# EAGLE design ATtiny_4585_and_4484_programmer (EAGLE 6.1)
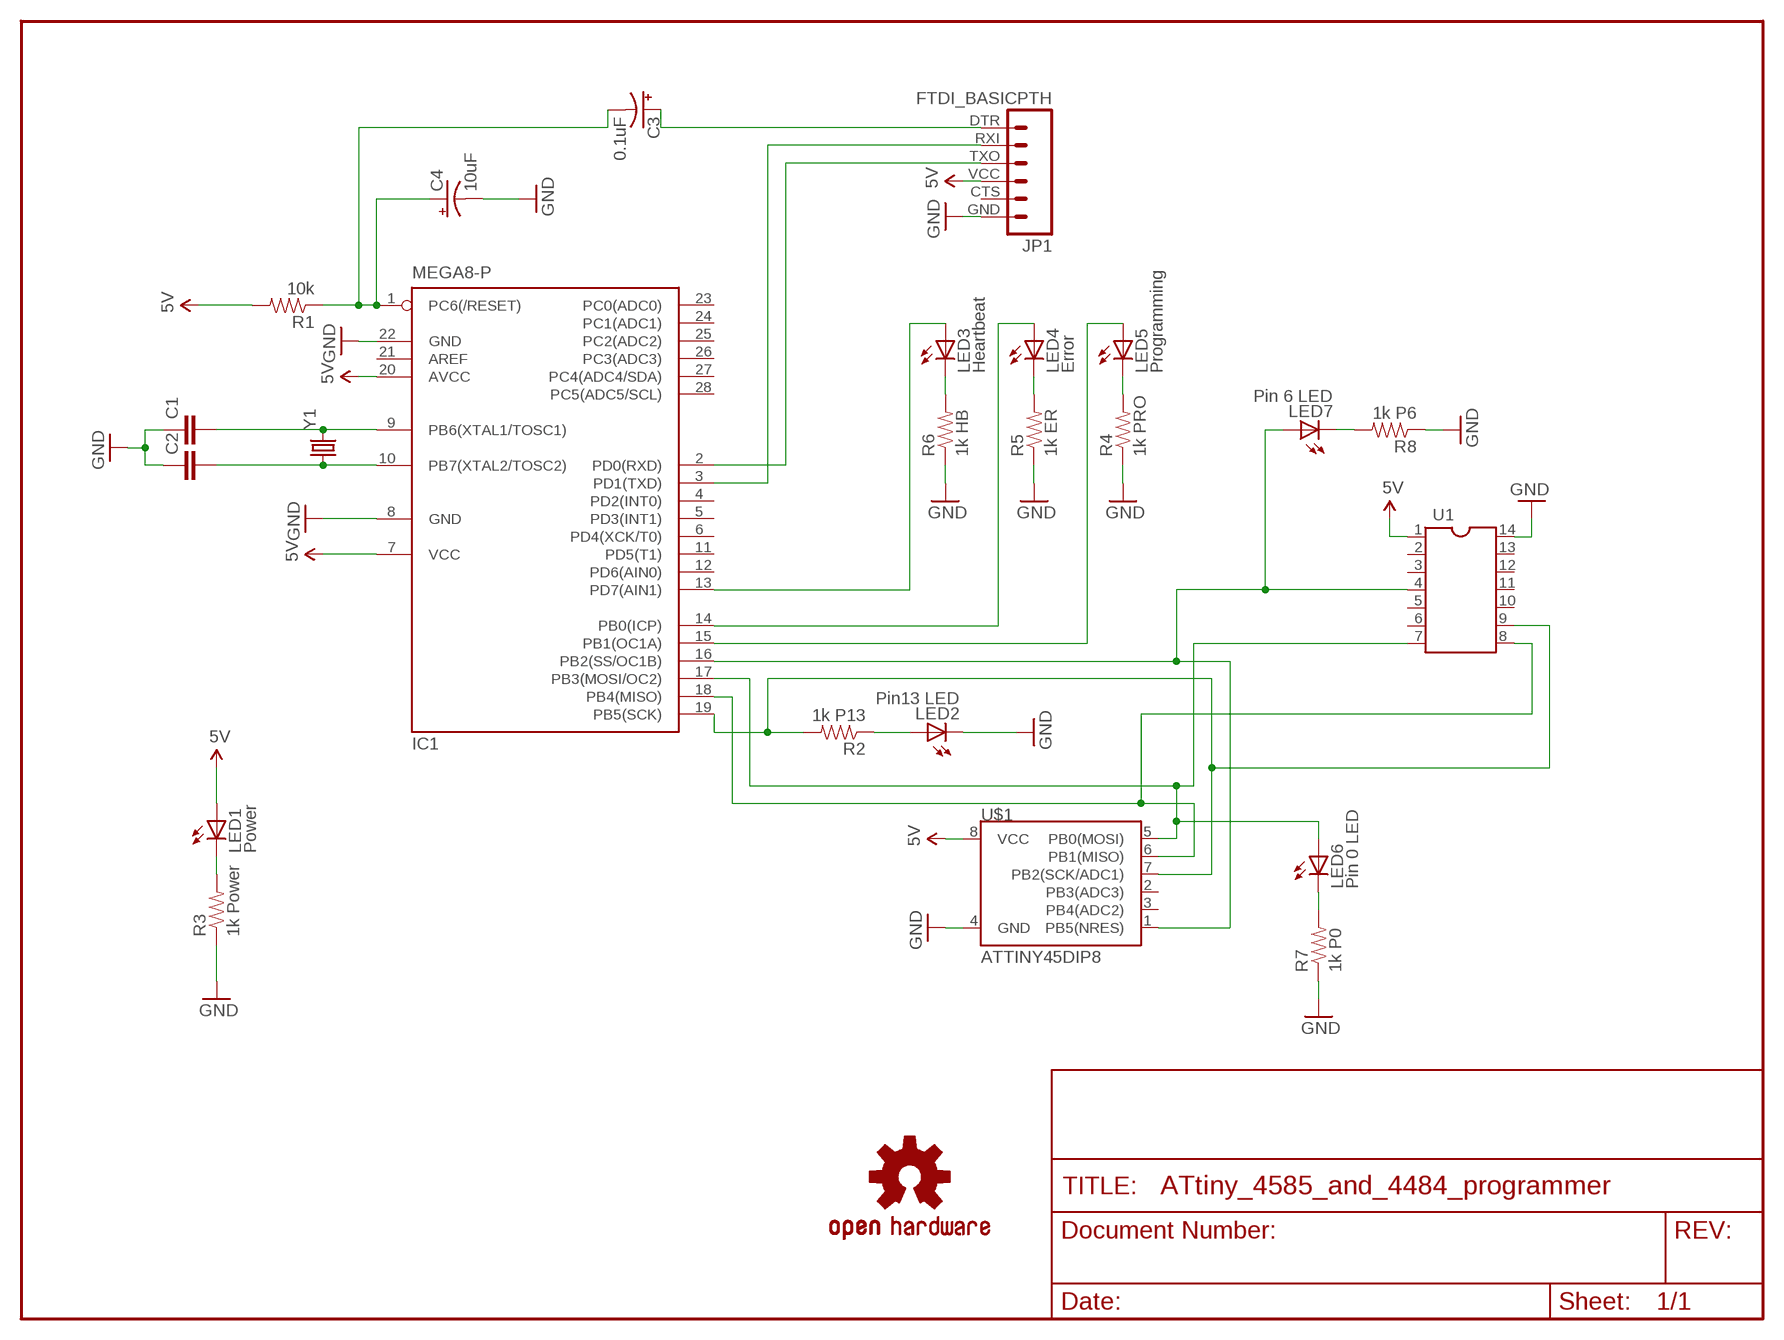
[diagram p0: schematic, sheet 1]

## Parts
C1  CAPPTH  [CAP-PTH-SMALL]
C2  CAPPTH  [CAP-PTH-SMALL]
C3  0.1uF  CAP_POLPTH2  [CPOL-RADIAL-10UF-25V]
C4  10uF  CAP_POLPTH2  [CPOL-RADIAL-10UF-25V]
IC1  MEGA8-P  [DIL28-3]
JP1  FTDI_BASICPTH  [FTDI_BASIC]
LED1  Power  LED5MM  [LED5MM]
LED2  Pin13 LED  LED5MM  [LED5MM]
LED3  Heartbeat  LED5MM  [LED5MM]
LED4  Error  LED5MM  [LED5MM]
LED5  Programming  LED5MM  [LED5MM]
LED6  Pin 0 LED  LED5MM  [LED5MM]
LED7  Pin 6 LED  LED5MM  [LED5MM]
R1  10k  RESISTORPTH-1/4W  [AXIAL-0.4]
R2  1k P13  RESISTORPTH-1/4W  [AXIAL-0.4]
R3  1k Power  RESISTORPTH-1/4W  [AXIAL-0.4]
R4  1k PRO  RESISTORPTH-1/4W  [AXIAL-0.4]
R5  1k ER  RESISTORPTH-1/4W  [AXIAL-0.4]
R6  1k HB  RESISTORPTH-1/4W  [AXIAL-0.4]
R7  1k P0  RESISTORPTH-1/4W  [AXIAL-0.4]
R8  1k P6  RESISTORPTH-1/4W  [AXIAL-0.4]
U1  DIL14  [DIL14]
U$1  ATTINY45DIP8  [DIP08]
U$9  OSHW-LOGOM  [OSHW-LOGO-M]
Y1  CRYSTALHC49US  [HC49US]

## Nets
5V: IC1.7(VCC) IC1.20(AVCC) JP1.VCC LED1.A R1.P$2 U1.1 U$1.8(VCC)
GND: C1.1 C2.1 C4.2(-) IC1.8(GND) IC1.22(GND) JP1.GND LED2.K(C) R3.P$1 R4.P$1 R5.P$1 R6.P$1 R7.P$1 R8.P$1 U1.14 U$1.4(GND)
N$1: C1.2 IC1.9(PB6(XTAL1/TOSC1)) Y1.2
N$2: C2.2 IC1.10(PB7(XTAL2/TOSC2)) Y1.1
N$3: C3.1(+) JP1.DTR
N$6: IC1.16(PB2(SS/OC1B)) LED7.A U1.4 U$1.1(PB5(NRES))
N$7: IC1.3(PD1(TXD)) JP1.RXI
N$8: IC1.2(PD0(RXD)) JP1.TXO
N$9: LED1.K(C) R3.P$2
N$10: IC1.19(PB5(SCK)) R2.P$2 U1.9 U$1.7(PB2(SCK/ADC1))
N$11: LED2.A R2.P$1
N$12: IC1.17(PB3(MOSI/OC2)) LED6.A U1.7 U$1.5(PB0(MOSI))
N$13: IC1.18(PB4(MISO)) U1.8 U$1.6(PB1(MISO))
N$14: IC1.14(PB0(ICP)) LED4.A
N$15: IC1.13(PD7(AIN1)) LED3.A
N$16: LED3.K(C) R6.P$2
N$17: LED4.K(C) R5.P$2
N$18: LED5.K(C) R4.P$2
N$19: IC1.15(PB1(OC1A)) LED5.A
N$20: C3.2(-) C4.1(+) IC1.1(PC6(/RESET)) R1.P$1
N$21: LED6.K(C) R7.P$2
N$22: LED7.K(C) R8.P$2
Unconnected: IC1.4(PD2(INT0)) IC1.5(PD3(INT1)) IC1.6(PD4(XCK/T0)) IC1.11(PD5(T1)) IC1.12(PD6(AIN0)) IC1.21(AREF) IC1.23(PC0(ADC0)) IC1.24(PC1(ADC1)) IC1.25(PC2(ADC2)) IC1.26(PC3(ADC3)) IC1.27(PC4(ADC4/SDA)) IC1.28(PC5(ADC5/SCL)) JP1.CTS U1.2 U1.3 U1.5 U1.6 U1.10 U1.11 U1.12 U1.13 U$1.2(PB3(ADC3)) U$1.3(PB4(ADC2))

## Library data of the parts
C1 C2 = SparkFun:CAP: Capacitor Standard 0603 ceramic capacitor, and 0.1" leaded capacitor.
C3 C4 = SparkFun:CAP_POL: Capacitor Polarized These are standard SMD and PTH capacitors. Normally 10uF, 47uF, and 100uF in electrolytic and tantalum varieties. Always verify the external diameter of the through hole cap, it varies with capacity, voltage, and manufacturer. The EIA devices should be standard.
IC1 = atmel:MEGA8-P: MICROCONTROLLER 8 Kbytes FLASH, 1 kbytes SRAM, 512 bytes EEPROM, USART, 4-channel 10 bit ADC, 2-channel 8 bit ADC Pin compatible with Atmega48, ATMega88, ATMega168 Source: avr.lbr; OC_FARNELL: unknown; OC_NEWARK: unknown
JP1 = SparkFun:FTDI_BASIC: FTDI Basic: 3.3V and 5V
LED1-LED7 = SparkFun:LED: LEDs Standard schematic elements and footprints for 5mm, 3mm, 1206, and 0603 sized LEDs. 5mm - Spark Fun Electronics SKU : COM-00529 (and others)
R1-R8 = SparkFun:RESISTOR: Resistor Basic schematic elements and footprints for 0603, 1206, and PTH resistors.
U1 = map:DIL14
U$1 = SparkFun:ATTINY45: Atmel ATTiny45
U$9 = SparkFun:OSHW-LOGO: Open Source Hardware Logo This logo indicates the piece of hardware it is found on incorporates a OSHW license and/or adheres to the definition of open source hardware found here: http://freedomdefined.org/OSHW
Y1 = SparkFun:CRYSTAL: Crystals Various standard crystals. Proven footprints. Spark Fun Electronics SKU : COM-00534

## Board
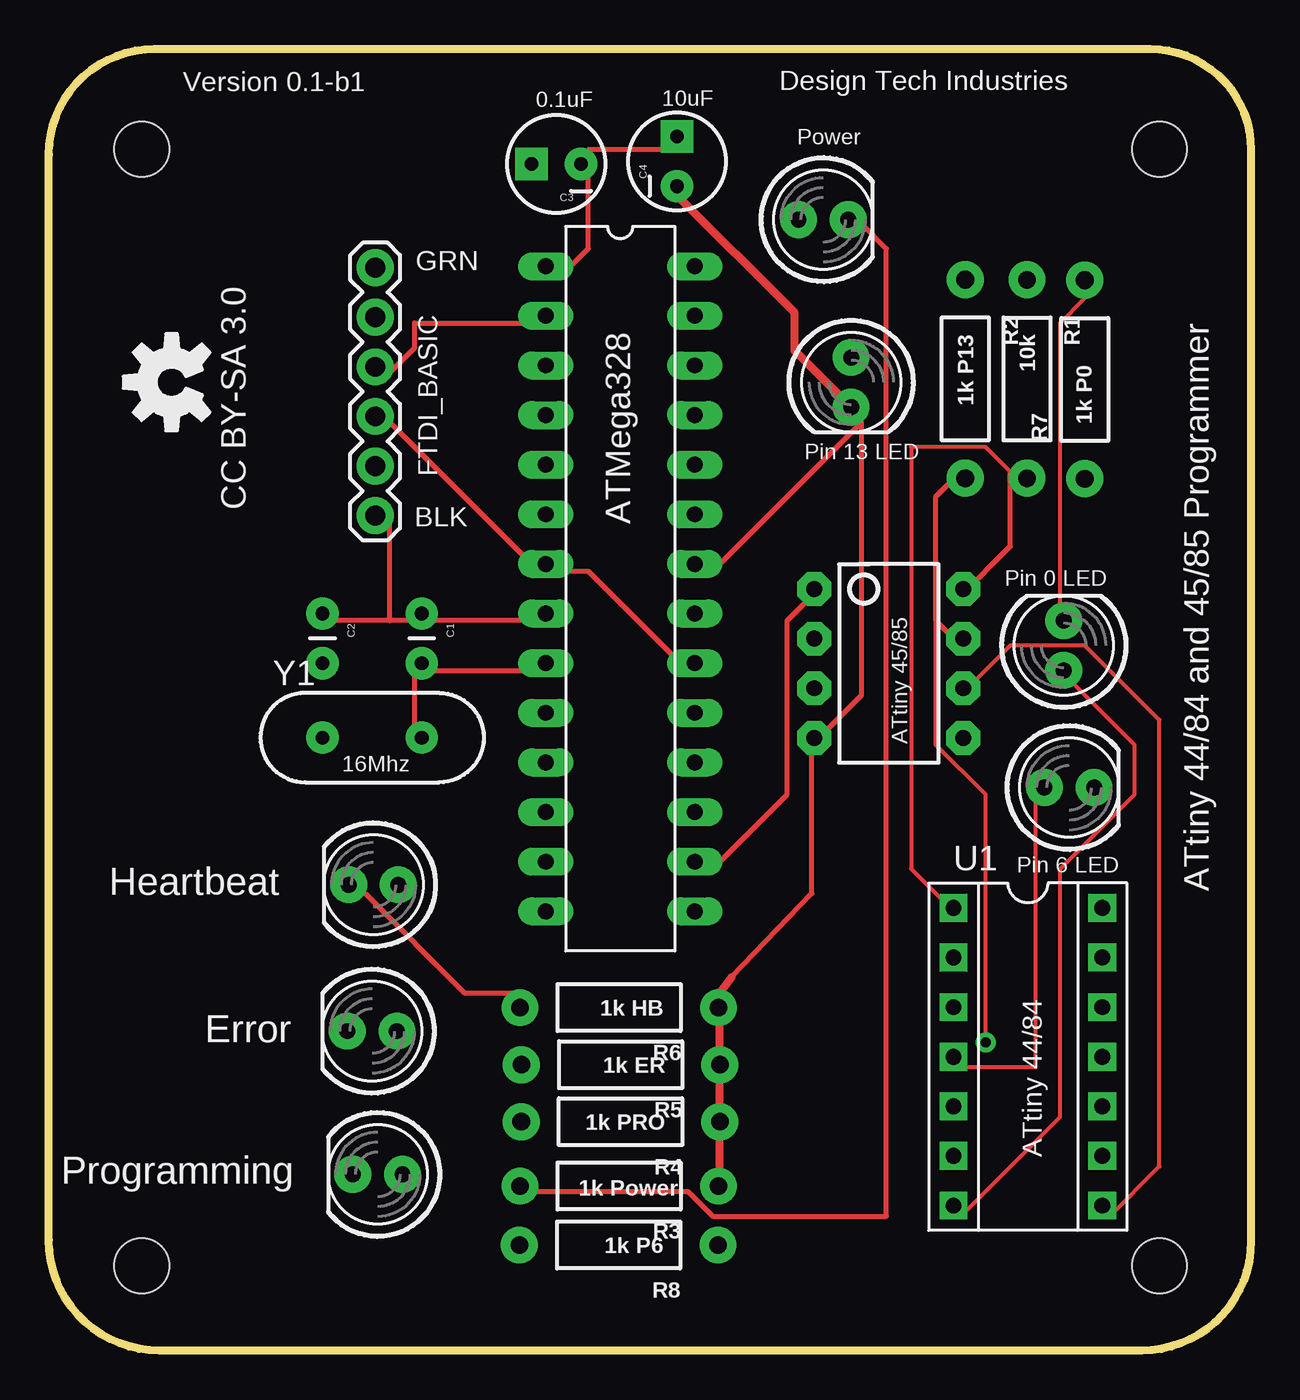
[diagram p1: board, top side]
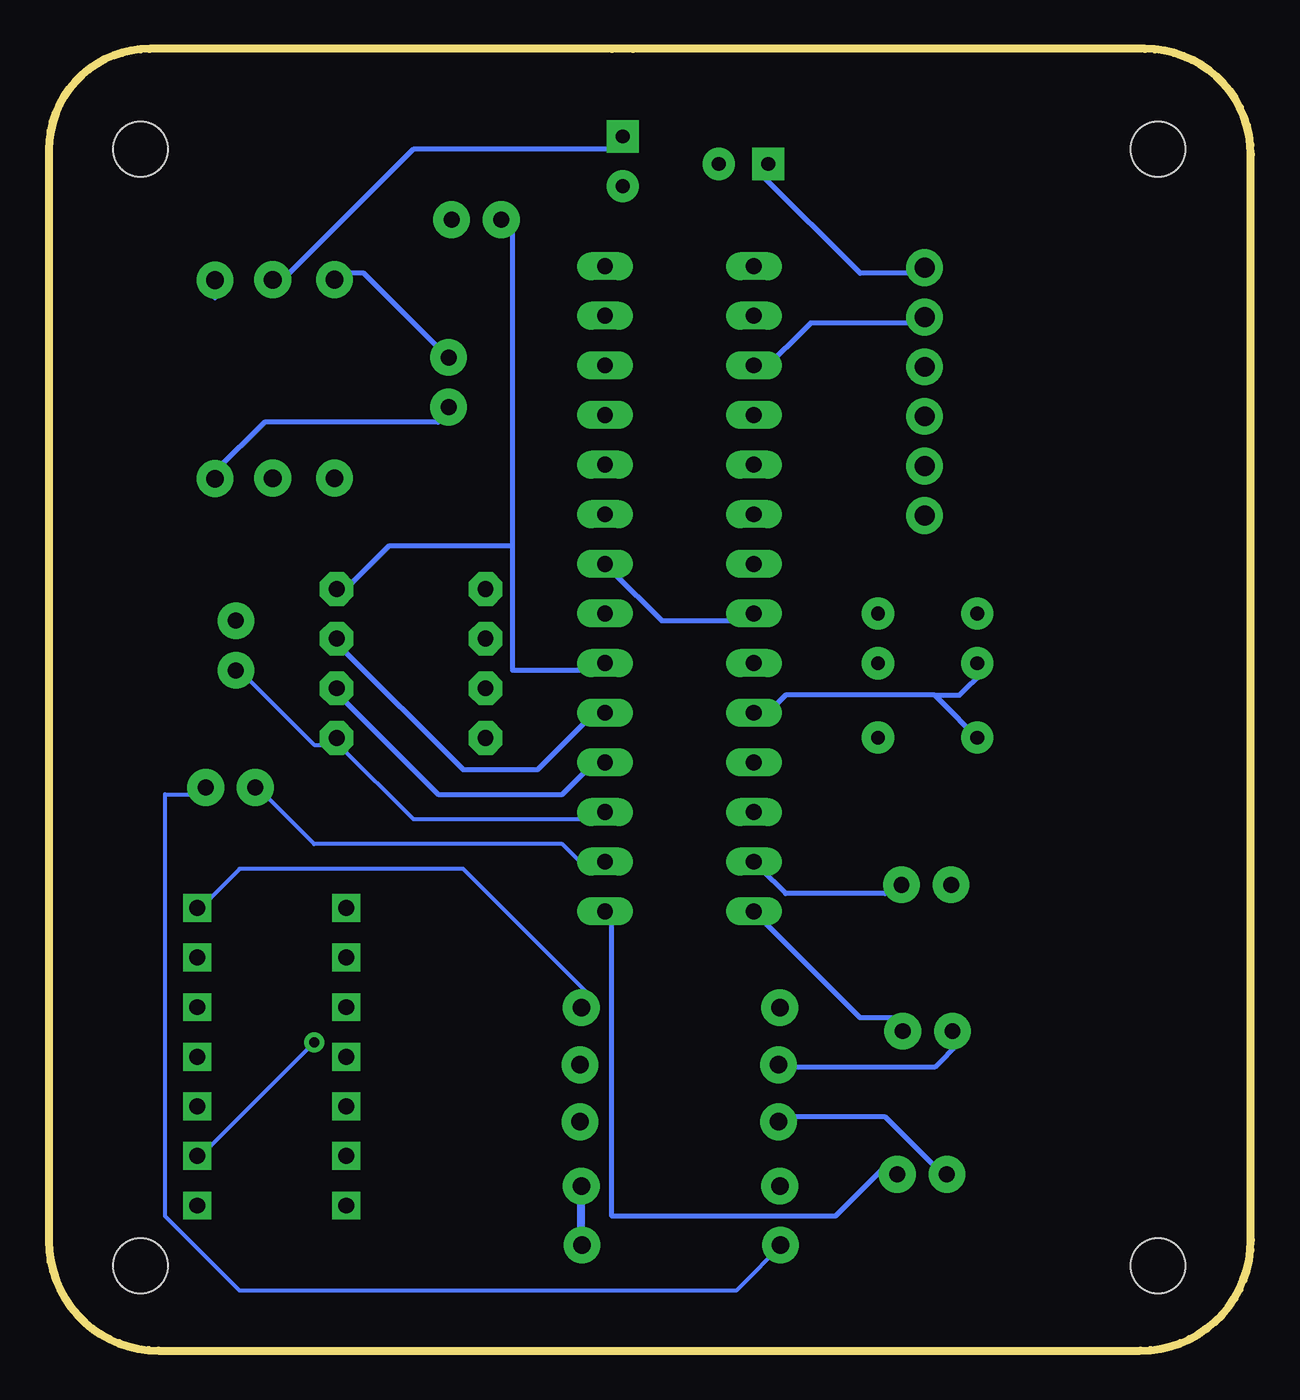
[diagram p2: board, bottom side, seen from below]

Size 61.5 x 66.63 mm. Coordinates in mm from the lower left corner, seen from the top.
Outline: 31.61,66.63 56.35,66.63 arc-90 61.51,61.47 61.51,5.6 arc-90 55.9,0 5.66,0 arc-90 0,5.66 0,61.22 arc-90 5.42,66.63 32.7,66.63
Copper layers (1*16): Top 0.035mm / dielectric 1.5mm / Bottom 0.035mm
Design rules: minimum track width 8mil, minimum drill 20mil, track to track 8mil, track to pad 8mil, pad to pad 8mil, via to via 8mil, smd to smd 8mil, copper to edge 10mil, drill to drill 8mil, minimum pad ring 12mil, minimum via ring 10mil, stop-mask expansion 4mil, vias tented up to drill 25mil, thermal gap 10mil
Holes 2.8 mm at 4.75,4.34 56.82,4.34 56.82,61.49 4.75,61.49

### Footprints (pad centres in the part's own frame; a part is rotated, then mirrored left to right if it is on the bottom)
CAP-PTH-SMALL = drill 0.7 pad 1.651: 1 0,0; 2 2.54,0
CPOL-RADIAL-10UF-25V = drill 0.7 pad 1.651 square: 1 1.27,0 | drill 0.7 pad 1.651: 2 -1.27,0
DIL28-3 = drill 0.813 long: 1 -16.51,-3.81; 2 -13.97,-3.81; 3 -11.43,-3.81; 4 -8.89,-3.81; 5 -6.35,-3.81; 6 -3.81,-3.81; 7 -1.27,-3.81; 8 1.27,-3.81; 9 3.81,-3.81; 10 6.35,-3.81; 11 8.89,-3.81; 12 11.43,-3.81; 13 13.97,-3.81; 14 16.51,-3.81; 15 16.51,3.81; 16 13.97,3.81; 17 11.43,3.81; 18 8.89,3.81; 19 6.35,3.81; 20 3.81,3.81; 21 1.27,3.81; 22 -1.27,3.81; 23 -3.81,3.81; 24 -6.35,3.81; 25 -8.89,3.81; 26 -11.43,3.81; 27 -13.97,3.81; 28 -16.51,3.81
FTDI_BASIC = drill 1.016 pad 1.88: CTS 10.16,0; DTR 0,0; GND 12.7,0; RXI 2.54,0; TXO 5.08,0; VCC 7.62,0
LED5MM = drill 0.813 pad 1.88: A -1.27,0; K 1.27,0
AXIAL-0.4 = drill 0.9 pad 1.88: P$1 -5.08,0; P$2 5.08,0
DIL14 = drill 0.813 square: 1 -7.62,-3.81; 2 -5.08,-3.81; 3 -2.54,-3.81; 4 0,-3.81; 5 2.54,-3.81; 6 5.08,-3.81; 7 7.62,-3.81; 8 7.62,3.81; 9 5.08,3.81; 10 2.54,3.81; 11 0,3.81; 12 -2.54,3.81; 13 -5.08,3.81; 14 -7.62,3.81
DIP08 = drill 0.813 pad 1.727 octagon: 1 -3.81,-3.81; 2 -1.27,-3.81; 3 1.27,-3.81; 4 3.81,-3.81; 5 3.81,3.81; 6 1.27,3.81; 7 -1.27,3.81; 8 -3.81,3.81
HC49US = drill 0.7 pad 1.651: 1 -2.54,0; 2 2.54,0

### Placement (x,y rotation side)
C1  19.08,37.73 270 top
C2  14,37.73 270 top
C3  25.96,60.75 180 top
C4  32.14,60.88 90 top
IC1  29.24,39 270 top
JP1  16.7,55.44 270 top
LED1  39.63,57.89 0 top
LED2  41.05,49.57 270 top
LED3  16.61,23.85 180 top
LED4  16.54,16.36 180 top
LED5  16.82,9.02 180 top
LED6  51.93,36.09 90 top
LED7  52.21,28.82 0 top
R1  50.05,49.74 270 top
R2  46.89,49.74 270 top
R3  29.18,8.43 180 top
R4  29.25,11.71 180 top
R5  29.25,14.63 180 top
R6  29.18,17.56 180 top
R7  53,49.71 90 top
R8  29.15,5.41 180 top
U1  50.1,15.04 270 top
U$1  42.97,35.17 270 top
U$9  6.28,49.57 90 top
Y1  16.54,31.38 0 top

### Tracks (layer width: path | path; a pad name or v marks a point on that pad's centre or on a via)
5V
  Top 0.203: 26.34,39.9 IC1.7 25.07,39.9 | 49.2,44.98 47.93,46.25 44.12,46.25 44.12,24.66 46.66,22.12 U1.1
  Top 0.254: U$1.8 46.66,38.63 49.2,41.17 49.2,44.98 R1.P$2 | 26.34,39.9 27.61,39.9 32.69,34.82 IC1.20 | 25.07,39.9 17.45,47.52 JP1.VCC
  Bottom 0.254: 37.77,41.17 37.77,34.82 33.96,34.82 IC1.20 | 37.77,41.17 37.77,57.68 LED1.A | 37.77,41.17 44.12,41.17 46.66,38.63 U$1.8
GND
  Top 0.254: 18.72,37.36 25.07,37.36 IC1.8 | 18.72,37.36 17.45,37.36 | 17.45,37.36 13.64,37.36 C2.1 | 18.72,37.36 C1.1 | 17.45,37.36 17.45,42.44 JP1.GND | 39.04,31.01 41.58,33.55 41.58,47.52 | 34.92,19.11 39.04,23.39 39.04,31.01 | 39.04,31.01 U$1.4 | 41.58,47.52 33.96,39.9 IC1.22 | 41.58,47.52 LED2.K
  Top 0.406: C4.2 32.14,59.15 38.16,53.12 38.16,51.18 LED2.K | R3.P$1 34.33,8.43 R4.P$1 R5.P$1 34.33,18.31 | 34.33,18.31 34.92,19.11 | 34.33,18.31 34.26,18.31 R6.P$1
  Bottom 0.203: U1.14 54.28,22.12 51.74,24.66 40.31,24.66 33.96,18.31 R6.P$1
  Bottom 0.254: IC1.22 32.69,39.9 30.15,37.36 26.34,37.36 IC1.8 | R7.P$1 53.01,44.98 50.47,47.52 41.58,47.52 LED2.K
  Bottom 0.406: R8.P$1 34.26,5.41 R3.P$1
N$1
  Top 0.254: 18.72,34.82 25.07,34.82 IC1.9 | 18.72,34.82 18.72,31.01 Y1.2 | 18.72,34.82 C1.2
N$2
  Bottom 0.254: 16.18,33.55 14.91,33.55 13.64,34.82 C2.2 | 16.18,33.55 23.8,33.55 25.07,32.28 IC1.10 | 16.18,33.55 13.64,31.01 Y1.1
N$3
  Bottom 0.254: C3.1 25.07,60.22 19.99,55.14 17.45,55.14 JP1.DTR
N$6
  Top 0.203: U1.4 46.66,14.5 50.47,14.5 50.47,28.47 LED7.A
  Top 0.254: IC1.16 33.96,24.66 37.77,28.47 37.77,37.36 39.04,38.63 U$1.1
  Bottom 0.203: LED7.A 50.47,28.47 47.93,25.93 35.23,25.93 33.96,24.66 IC1.16
N$7
  Bottom 0.254: IC1.3 25.07,50.06 22.53,52.6 17.45,52.6 JP1.RXI
N$8
  Top 0.254: IC1.2 25.07,52.6 18.72,52.6 18.72,51.33 17.45,50.06 JP1.TXO
N$9
  Top 0.254: R3.P$2 23.8,8.15 32.69,8.15 33.96,6.88 42.85,6.88 42.85,56.41 41.58,57.68 LED1.K
N$10  (via drill 0.51)
  Top 0.203: v47.93,15.77 47.93,28.47 45.39,31.01 45.39,37.36
  Top 0.254: R2.P$2 46.66,44.98 45.39,43.71 45.39,37.36 46.66,36.09 U$1.7
  Bottom 0.203: v47.93,15.77 54.28,9.42 U1.9
  Bottom 0.254: IC1.19 33.96,32.28 36.5,29.74 40.31,29.74 46.66,36.09 U$1.7
N$11
  Bottom 0.254: LED2.A 41.58,51.33 45.39,55.14 46.66,55.14 R2.P$1
N$12
  Top 0.203: U1.7 46.66,6.88 51.74,11.96 51.74,24.66 55.55,28.47 55.55,31.01 51.74,34.82 LED6.A
  Bottom 0.203: 46.66,31.01 42.85,27.2 33.96,27.2 IC1.17 | 46.66,31.01 47.93,31.01 51.74,34.82 LED6.A | 46.66,31.01 U$1.5
N$13
  Top 0.203: U1.8 54.28,6.88 56.82,9.42 56.82,32.28 53.01,36.09 49.2,36.09 46.66,33.55 U$1.6
  Bottom 0.254: IC1.18 33.96,29.74 35.23,28.47 41.58,28.47 46.66,33.55 U$1.6
N$14
  Bottom 0.254: IC1.14 25.07,22.12 19.99,17.04 17.45,17.04 LED4.A
N$15
  Bottom 0.254: IC1.13 25.07,24.66 23.8,23.39 18.72,23.39 LED3.A
N$16
  Top 0.254: LED3.K 16.18,23.39 21.26,18.31 23.8,18.31 R6.P$2
N$17
  Bottom 0.254: LED4.K 14.91,15.77 16.18,14.5 23.8,14.5 R5.P$2
N$18
  Bottom 0.254: LED5.K 16.18,9.42 18.72,11.96 23.8,11.96 R4.P$2
N$19
  Bottom 0.254: IC1.15 32.69,22.12 32.69,6.88 21.26,6.88 18.72,9.42 LED5.A
N$20
  Top 0.254: IC1.1 26.34,55.14 27.61,56.41 27.61,60.22 C3.2 27.61,61.49 31.42,61.49 C4.1
  Bottom 0.254: R1.P$1 49.2,55.14 42.85,61.49 32.69,61.49 C4.1
N$21
  Top 0.203: LED6.K 51.74,37.36 51.74,52.6 53.01,53.87 R7.P$2
  Bottom 0.254: R7.P$2 53.01,53.87
N$22
  Bottom 0.203: R8.P$2 23.8,5.61 26.34,3.07 51.74,3.07 55.55,6.88 55.55,28.47 54.28,28.47 LED7.K

### Text on the board
tPlace: Version 0.1-b1 | 0.1uF | 10uF | Design Tech Industries | Power | GRN | ATtiny 44/84 and 45/85 Programmer | Pin 13 LED | FTDI_BASIC | CC BY-SA 3.0 | BLK | ATMega328 | Pin 0 LED | 16Mhz | ATtiny 45/85 | Pin 6 LED | Heartbeat | Error | ATtiny 44/84 | Programming